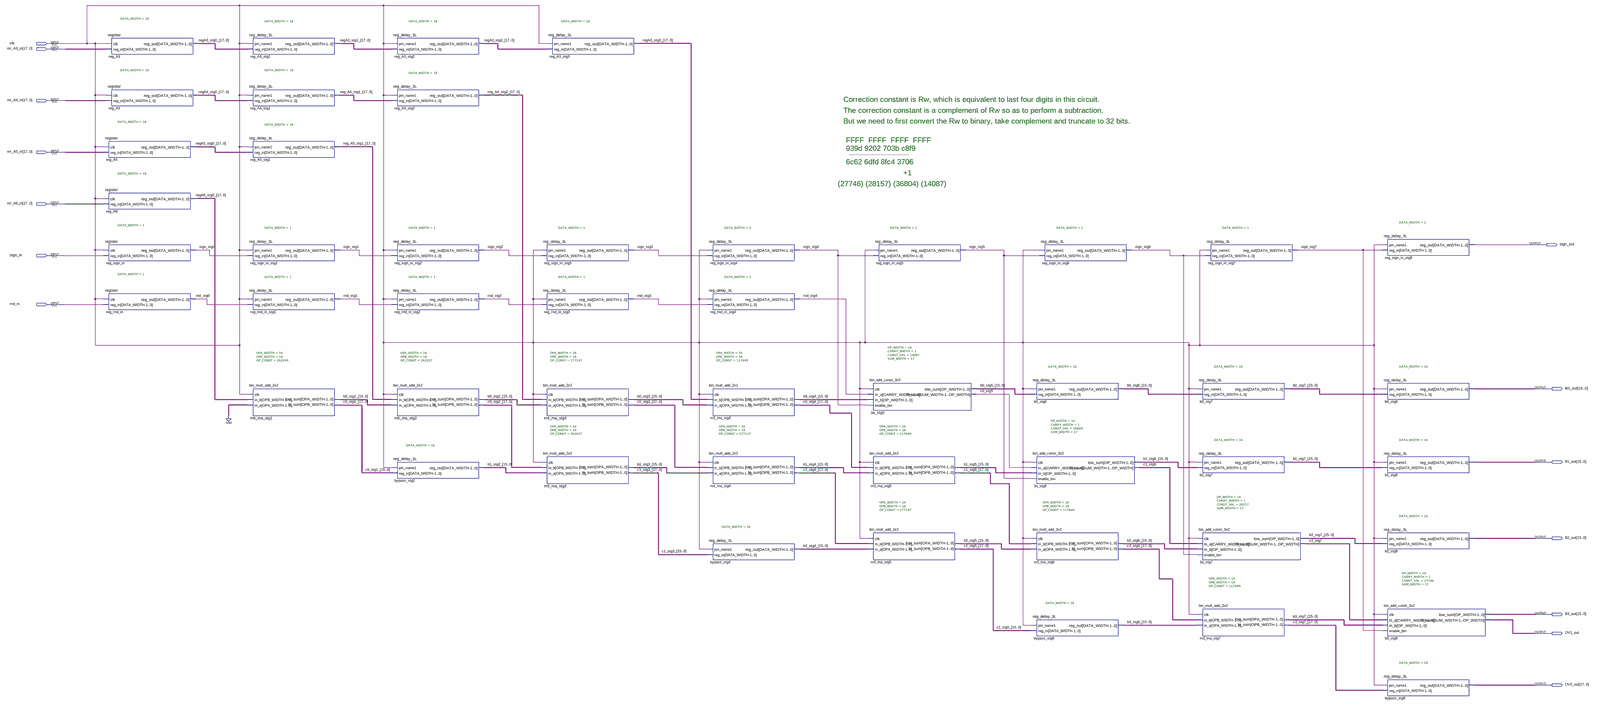
[diagram p0: schematic sheet, whole]
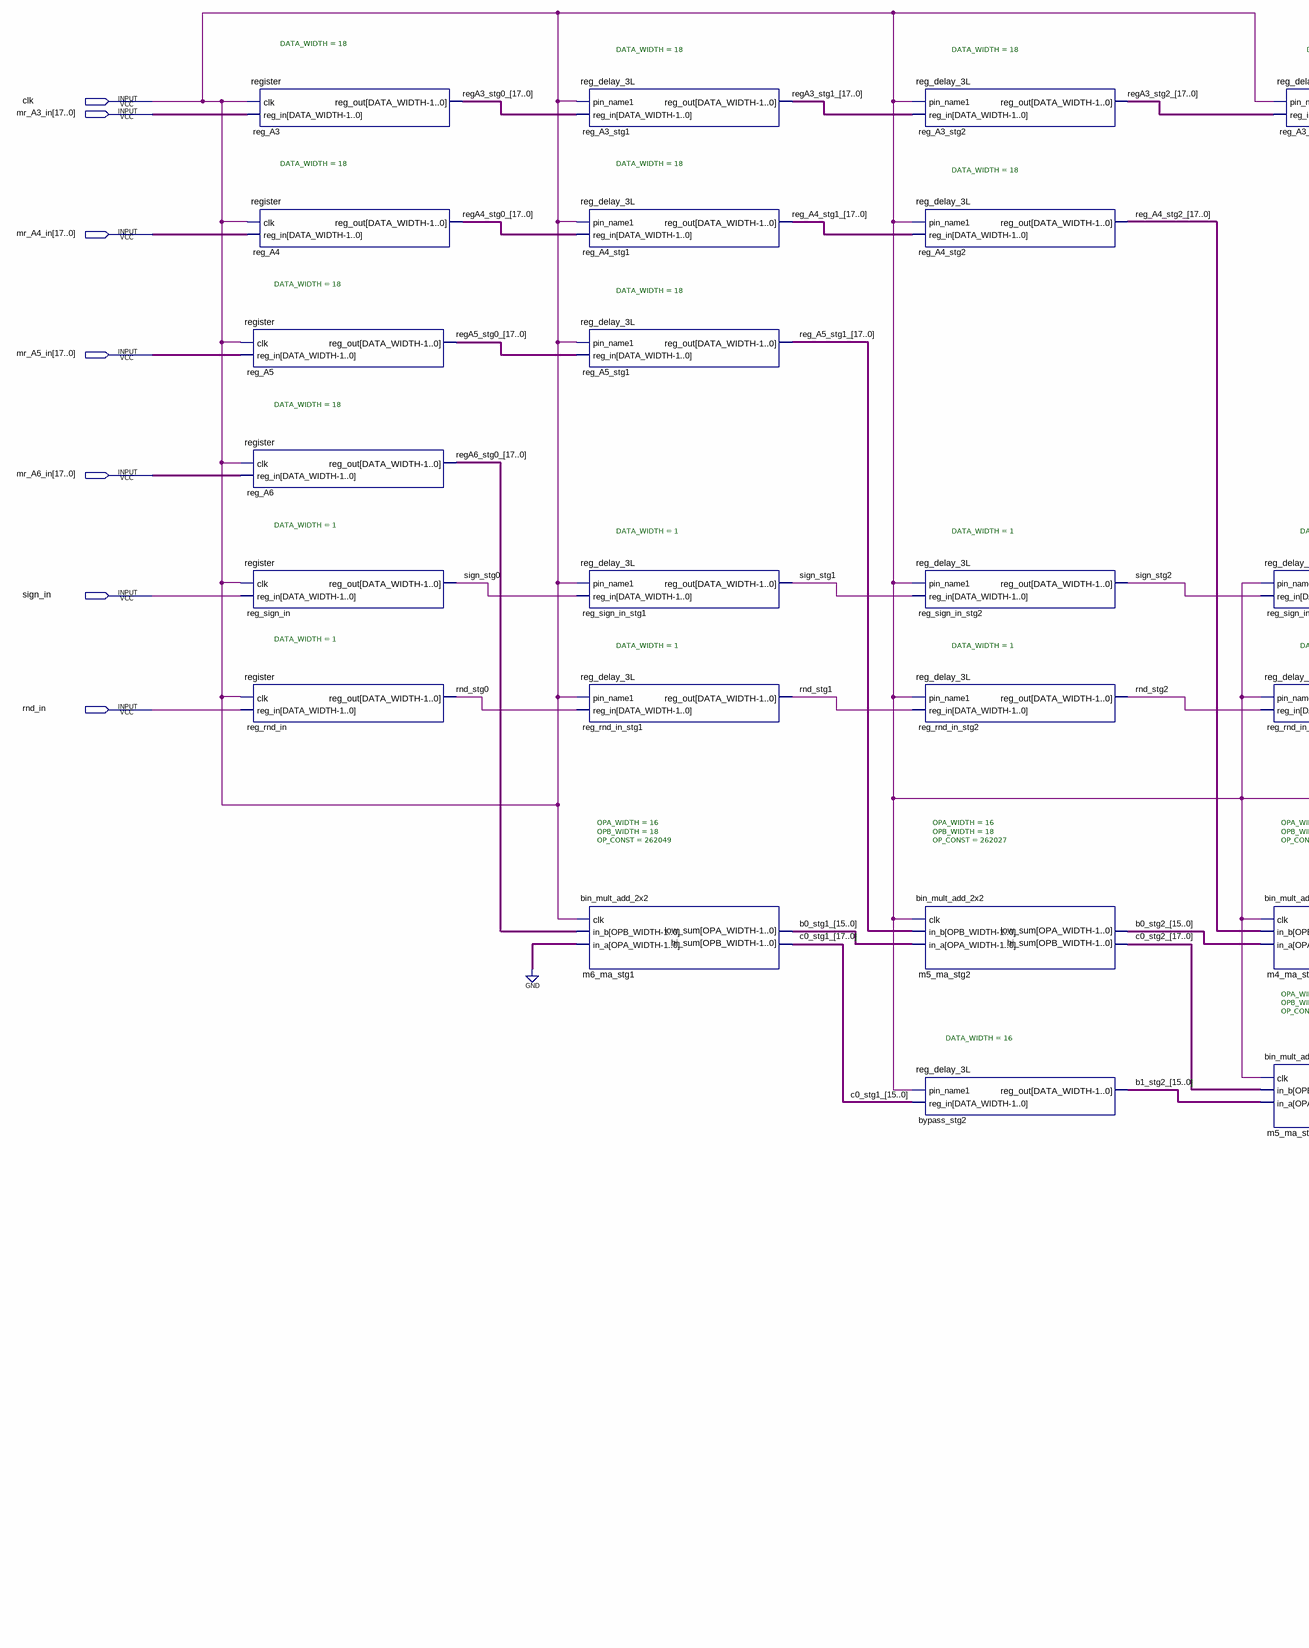
[diagram p1: schematic sheet, left part]
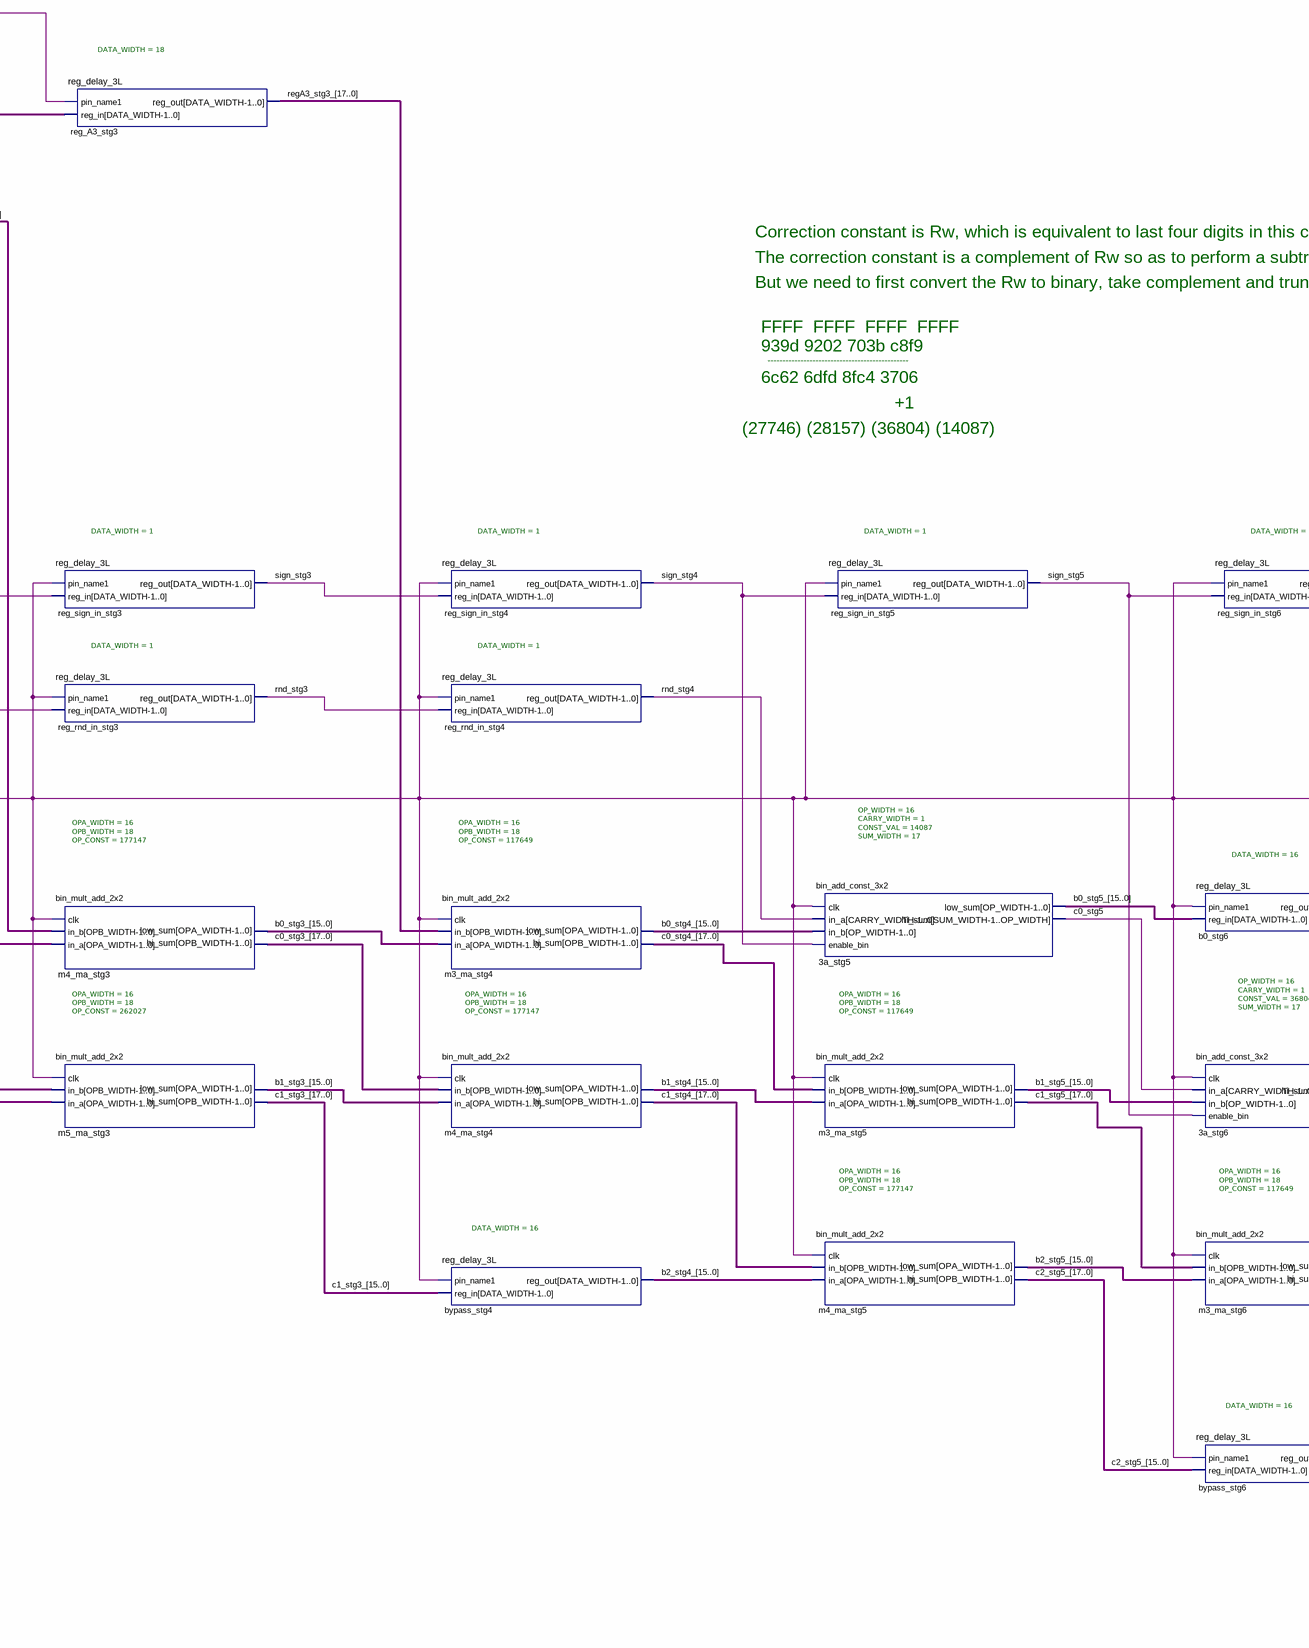
[diagram p2: schematic sheet, centre part]
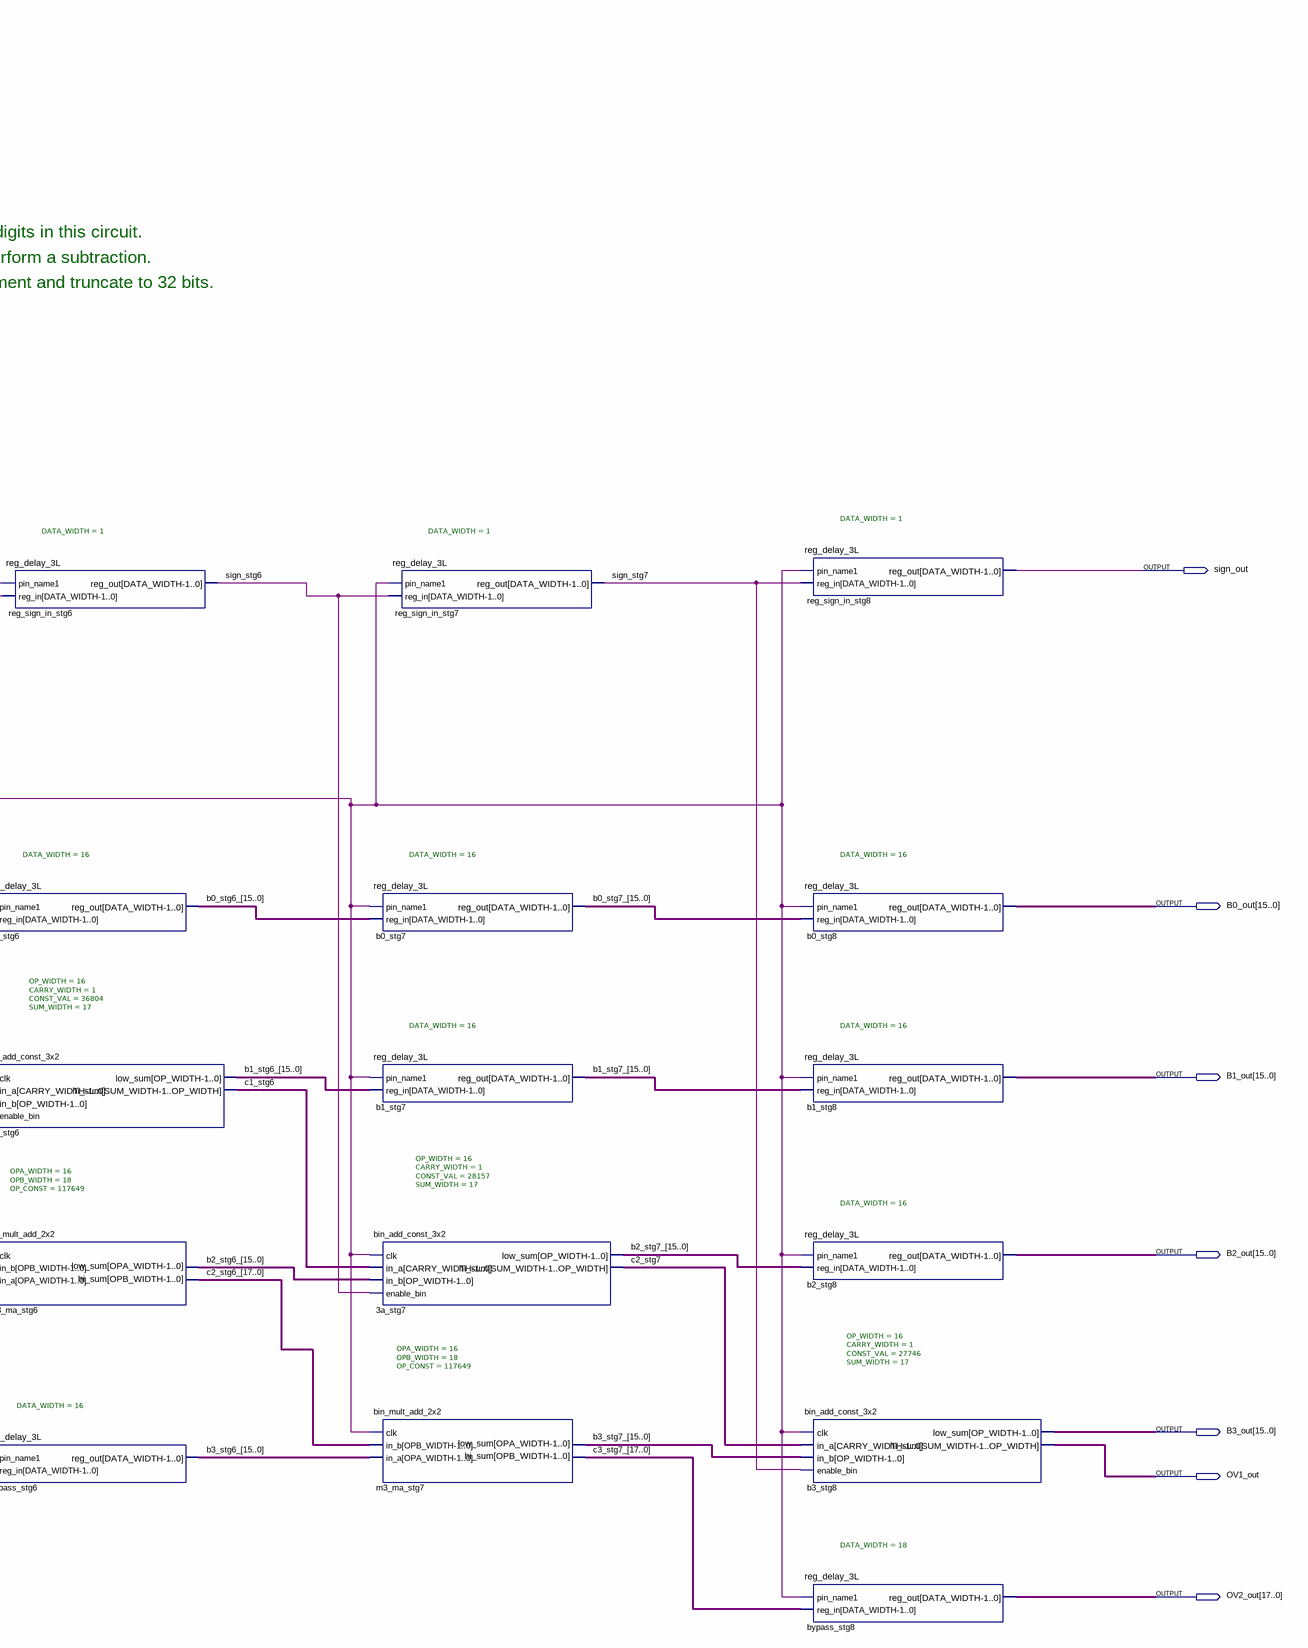
[diagram p3: schematic sheet, right part]
// Quartus schematic RFracConv18_16_stg2.bdf as structural Verilog: 48 symbols, 14 pins
module RFracConv18_16_stg2 (
  input  clk,
  input  [17:0] mr_A3_in,
  input  [17:0] mr_A4_in,
  input  [17:0] mr_A5_in,
  input  [17:0] mr_A6_in,
  input  sign_in,
  input  rnd_in,
  output sign_out,
  output [15:0] B0_out,
  output [15:0] B1_out,
  output [15:0] B2_out,
  output [15:0] B3_out,
  output OV1_out,
  output [17:0] OV2_out
);

  wire c0_stg5, c1_stg6, c2_stg7, rnd_stg0, rnd_stg1, rnd_stg2, rnd_stg3, rnd_stg4, sign_stg0, sign_stg1,
       sign_stg2, sign_stg3, sign_stg4, sign_stg5, sign_stg6, sign_stg7;
  wire [15:0] b0_stg1_, b0_stg2_, b0_stg3_, b0_stg4_, b0_stg5_, b0_stg6_, b0_stg7_, b1_stg2_, b1_stg3_,
       b1_stg4_, b1_stg5_, b1_stg6_, b1_stg7_, b2_stg4_, b2_stg5_, b2_stg6_, b2_stg7_, b3_stg6_, b3_stg7_;
  wire [17:0] c0_stg1_, c0_stg2_, c0_stg3_, c0_stg4_, c1_stg3_, c1_stg4_, c1_stg5_, c2_stg5_, c2_stg6_,
       c3_stg7_, reg_A4_stg1_, reg_A4_stg2_, reg_A5_stg1_, regA3_stg0_, regA3_stg1_, regA3_stg2_,
       regA3_stg3_, regA4_stg0_, regA5_stg0_, regA6_stg0_;

  register #(.DATA_WIDTH(18)) reg_A3 (.clk(clk), .reg_in(mr_A3_in), .reg_out(regA3_stg0_));
  register #(.DATA_WIDTH(18)) reg_A4 (.clk(clk), .reg_in(mr_A4_in), .reg_out(regA4_stg0_));
  register #(.DATA_WIDTH(18)) reg_A5 (.clk(clk), .reg_in(mr_A5_in), .reg_out(regA5_stg0_));
  register #(.DATA_WIDTH(18)) reg_A6 (.clk(clk), .reg_in(mr_A6_in), .reg_out(regA6_stg0_));
  register #(.DATA_WIDTH(1)) reg_sign_in (.clk(clk), .reg_in(sign_in), .reg_out(sign_stg0));
  register #(.DATA_WIDTH(1)) reg_rnd_in (.clk(clk), .reg_in(rnd_in), .reg_out(rnd_stg0));
  reg_delay_3L #(.DATA_WIDTH(18)) reg_A3_stg1 (.pin_name1(clk), .reg_in(regA3_stg0_), .reg_out(regA3_stg1_));
  reg_delay_3L #(.DATA_WIDTH(18)) reg_A4_stg1 (.pin_name1(clk), .reg_in(regA4_stg0_), .reg_out(reg_A4_stg1_));
  reg_delay_3L #(.DATA_WIDTH(18)) reg_A5_stg1 (.pin_name1(clk), .reg_in(regA5_stg0_), .reg_out(reg_A5_stg1_));
  reg_delay_3L #(.DATA_WIDTH(1)) reg_sign_in_stg1 (.pin_name1(clk), .reg_in(sign_stg0), .reg_out(sign_stg1));
  reg_delay_3L #(.DATA_WIDTH(1)) reg_rnd_in_stg1 (.pin_name1(clk), .reg_in(rnd_stg0), .reg_out(rnd_stg1));
  bin_mult_add_2x2 #(.OPA_WIDTH(16), .OPB_WIDTH(18), .OP_CONST(262049)) m6_ma_stg1 (
    .clk(clk), .in_a({16{1'b0}}), .in_b(regA6_stg0_), .low_sum(b0_stg1_), .hi_sum(c0_stg1_));
  reg_delay_3L #(.DATA_WIDTH(18)) reg_A3_stg2 (.pin_name1(clk), .reg_in(regA3_stg1_), .reg_out(regA3_stg2_));
  reg_delay_3L #(.DATA_WIDTH(18)) reg_A4_stg2 (.pin_name1(clk), .reg_in(reg_A4_stg1_), .reg_out(reg_A4_stg2_));
  reg_delay_3L #(.DATA_WIDTH(1)) reg_sign_in_stg2 (.pin_name1(clk), .reg_in(sign_stg1), .reg_out(sign_stg2));
  reg_delay_3L #(.DATA_WIDTH(1)) reg_rnd_in_stg2 (.pin_name1(clk), .reg_in(rnd_stg1), .reg_out(rnd_stg2));
  bin_mult_add_2x2 #(.OPA_WIDTH(16), .OPB_WIDTH(18), .OP_CONST(262027)) m5_ma_stg2 (
    .clk(clk), .in_a(b0_stg1_), .in_b(reg_A5_stg1_), .low_sum(b0_stg2_), .hi_sum(c0_stg2_));
  reg_delay_3L #(.DATA_WIDTH(16)) bypass_stg2 (.pin_name1(clk), .reg_in(c0_stg1_[15:0]), .reg_out(b1_stg2_));
  reg_delay_3L #(.DATA_WIDTH(1)) reg_sign_in_stg3 (.pin_name1(clk), .reg_in(sign_stg2), .reg_out(sign_stg3));
  reg_delay_3L #(.DATA_WIDTH(1)) reg_rnd_in_stg3 (.pin_name1(clk), .reg_in(rnd_stg2), .reg_out(rnd_stg3));
  bin_mult_add_2x2 #(.OPA_WIDTH(16), .OPB_WIDTH(18), .OP_CONST(177147)) m4_ma_stg3 (
    .clk(clk), .in_a(b0_stg2_), .in_b(reg_A4_stg2_), .low_sum(b0_stg3_), .hi_sum(c0_stg3_));
  bin_mult_add_2x2 #(.OPA_WIDTH(16), .OPB_WIDTH(18), .OP_CONST(262027)) m5_ma_stg3 (
    .clk(clk), .in_a(b1_stg2_), .in_b(c0_stg2_), .low_sum(b1_stg3_), .hi_sum(c1_stg3_));
  reg_delay_3L #(.DATA_WIDTH(18)) reg_A3_stg3 (.pin_name1(clk), .reg_in(regA3_stg2_), .reg_out(regA3_stg3_));
  reg_delay_3L #(.DATA_WIDTH(1)) reg_sign_in_stg4 (.pin_name1(clk), .reg_in(sign_stg3), .reg_out(sign_stg4));
  reg_delay_3L #(.DATA_WIDTH(1)) reg_rnd_in_stg4 (.pin_name1(clk), .reg_in(rnd_stg3), .reg_out(rnd_stg4));
  bin_mult_add_2x2 #(.OPA_WIDTH(16), .OPB_WIDTH(18), .OP_CONST(117649)) m3_ma_stg4 (
    .clk(clk), .in_a(b0_stg3_), .in_b(regA3_stg3_), .low_sum(b0_stg4_), .hi_sum(c0_stg4_));
  bin_mult_add_2x2 #(.OPA_WIDTH(16), .OPB_WIDTH(18), .OP_CONST(177147)) m4_ma_stg4 (
    .clk(clk), .in_a(b1_stg3_), .in_b(c0_stg3_), .low_sum(b1_stg4_), .hi_sum(c1_stg4_));
  reg_delay_3L #(.DATA_WIDTH(16)) bypass_stg4 (.pin_name1(clk), .reg_in(c1_stg3_[15:0]), .reg_out(b2_stg4_));
  bin_add_const_3x2 #(.OP_WIDTH(16), .CARRY_WIDTH(1), .CONST_VAL(14087), .SUM_WIDTH(17)) u_3a_stg5 (
    .clk(clk), .in_a(rnd_stg4), .in_b(b0_stg4_), .enable_bin(sign_stg4), .low_sum(b0_stg5_), .hi_sum(c0_stg5));
  bin_mult_add_2x2 #(.OPA_WIDTH(16), .OPB_WIDTH(18), .OP_CONST(117649)) m3_ma_stg5 (
    .clk(clk), .in_a(b1_stg4_), .in_b(c0_stg4_), .low_sum(b1_stg5_), .hi_sum(c1_stg5_));
  bin_mult_add_2x2 #(.OPA_WIDTH(16), .OPB_WIDTH(18), .OP_CONST(177147)) m4_ma_stg5 (
    .clk(clk), .in_a(b2_stg4_), .in_b(c1_stg4_), .low_sum(b2_stg5_), .hi_sum(c2_stg5_));
  reg_delay_3L #(.DATA_WIDTH(1)) reg_sign_in_stg5 (.pin_name1(clk), .reg_in(sign_stg4), .reg_out(sign_stg5));
  reg_delay_3L #(.DATA_WIDTH(1)) reg_sign_in_stg6 (.pin_name1(clk), .reg_in(sign_stg5), .reg_out(sign_stg6));
  reg_delay_3L #(.DATA_WIDTH(16)) b0_stg6 (.pin_name1(clk), .reg_in(b0_stg5_), .reg_out(b0_stg6_));
  bin_add_const_3x2 #(.OP_WIDTH(16), .CARRY_WIDTH(1), .CONST_VAL(36804), .SUM_WIDTH(17)) u_3a_stg6 (
    .clk(clk), .in_a(c0_stg5), .in_b(b1_stg5_), .enable_bin(sign_stg5), .low_sum(b1_stg6_), .hi_sum(c1_stg6));
  bin_mult_add_2x2 #(.OPA_WIDTH(16), .OPB_WIDTH(18), .OP_CONST(117649)) m3_ma_stg6 (
    .clk(clk), .in_a(b2_stg5_), .in_b(c1_stg5_), .low_sum(b2_stg6_), .hi_sum(c2_stg6_));
  reg_delay_3L #(.DATA_WIDTH(16)) bypass_stg6 (.pin_name1(clk), .reg_in(c2_stg5_[15:0]), .reg_out(b3_stg6_));
  reg_delay_3L #(.DATA_WIDTH(1)) reg_sign_in_stg7 (.pin_name1(clk), .reg_in(sign_stg6), .reg_out(sign_stg7));
  reg_delay_3L #(.DATA_WIDTH(16)) b0_stg7 (.pin_name1(clk), .reg_in(b0_stg6_), .reg_out(b0_stg7_));
  reg_delay_3L #(.DATA_WIDTH(16)) b1_stg7 (.pin_name1(clk), .reg_in(b1_stg6_), .reg_out(b1_stg7_));
  bin_add_const_3x2 #(.OP_WIDTH(16), .CARRY_WIDTH(1), .CONST_VAL(28157), .SUM_WIDTH(17)) u_3a_stg7 (
    .clk(clk), .in_a(c1_stg6), .in_b(b2_stg6_), .enable_bin(sign_stg6), .low_sum(b2_stg7_), .hi_sum(c2_stg7));
  bin_mult_add_2x2 #(.OPA_WIDTH(16), .OPB_WIDTH(18), .OP_CONST(117649)) m3_ma_stg7 (
    .clk(clk), .in_a(b3_stg6_), .in_b(c2_stg6_), .low_sum(b3_stg7_), .hi_sum(c3_stg7_));
  reg_delay_3L #(.DATA_WIDTH(1)) reg_sign_in_stg8 (.pin_name1(clk), .reg_in(sign_stg7), .reg_out(sign_out));
  reg_delay_3L #(.DATA_WIDTH(16)) b0_stg8 (.pin_name1(clk), .reg_in(b0_stg7_), .reg_out(B0_out));
  reg_delay_3L #(.DATA_WIDTH(16)) b1_stg8 (.pin_name1(clk), .reg_in(b1_stg7_), .reg_out(B1_out));
  reg_delay_3L #(.DATA_WIDTH(16)) b2_stg8 (.pin_name1(clk), .reg_in(b2_stg7_), .reg_out(B2_out));
  bin_add_const_3x2 #(.OP_WIDTH(16), .CARRY_WIDTH(1), .CONST_VAL(27746), .SUM_WIDTH(17)) b3_stg8 (
    .clk(clk), .in_a(c2_stg7), .in_b(b3_stg7_), .enable_bin(sign_stg7), .low_sum(B3_out), .hi_sum(OV1_out));
  reg_delay_3L #(.DATA_WIDTH(18)) bypass_stg8 (.pin_name1(clk), .reg_in(c3_stg7_), .reg_out(OV2_out));

  // Notes on the sheet:
  //   Correction constant is Rw, which is equivalent to last four digits in this circuit.
  //   The correction constant is a complement of Rw so as to perform a subtraction.
  //   But we need to first convert the Rw to binary, take complement and truncate to 32 bits.
  //   FFFF  FFFF  FFFF  FFFF
  //   939d 9202 703b c8f9
  //   -----------------------------------------------
  //   6c62 6dfd 8fc4 3706
  //   +1
  //   (27746) (28157) (36804) (14087)
endmodule
